# Altium project GPS01-TD to PA1616D.PrjPcb
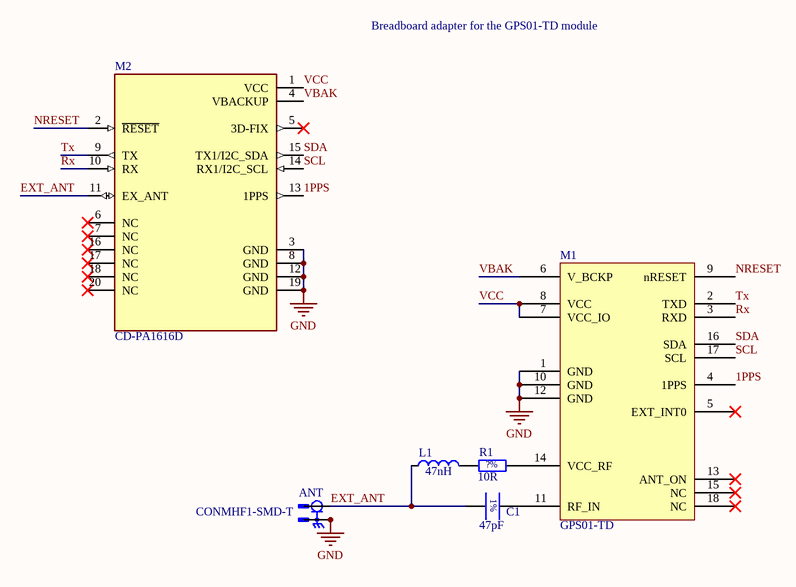
[diagram p0: Schematic.SchDoc]
1 sheet, 6 parts. Net scope: global (net labels, ports and power ports of the same name join across sheets).
Board file: PCB.PcbDoc

## Sheet Schematic.SchDoc
size A4

### Parts
ANT  CONMHF1-SMD-T  [TE_CONMHF1-SMD-T]
C1  47pF  [CAPACITOR_0805_2012M-70N]
L1  47nH  [RESISTOR_0805_2012M-50N]
M1  GPS01-TD  [GPS01-TD]
M2  CD-PA1616D  [XCVR_CD-PA1616D]
R1  10R  [RESISTOR_0805_2012M-50N]

### Nets
GND: ANT.2(GND) ANT.3(GND) ANT.4(GND) M1.1(GND) M1.10(GND) M1.12(GND) M2.3(GND) M2.8(GND) M2.12(GND) M2.19(GND)
1PPS: M1.4(1PPS) M2.13(1PPS)
EXT_ANT: ANT.1(SIG) C1.1 L1.1 M2.11(EX_ANT)
NRESET: M1.9(nRESET) M2.2(~{RESET})
Rx: M1.3(RXD) M2.10(RX)
SCL: M1.17(SCL) M2.14(RX1/I2C_SCL)
SDA: M1.16(SDA) M2.15(TX1/I2C_SDA)
Tx: M1.2(TXD) M2.9(TX)
VBAK: M1.6(V_BCKP) M2.4(VBACKUP)
VCC: M1.7(VCC_IO) M1.8(VCC) M2.1(VCC)
NetC1_2: C1.2 M1.11(RF_IN)
NetL1_2: L1.2 R1.1
NetM1_14: M1.14(VCC_RF) R1.2

Not connected (* = marked no-connect by the designer): M1 5(EXT_INT0)* 13(ANT_ON)* 15(NC)* 18(NC)*; M2 5(3D-FIX)* 6(NC)* 7(NC)* 16(NC)* 17(NC)* 18(NC)* 20(NC)*

### Notes on the sheet
- Breadboard adapter for the GPS01-TD module

### Library data of the parts
C1 = Generic Capacitor: Passive - Capacitor, Generic; Tolerance: 1%; MF Part No.: *; Value: 47pF
L1 = Generic Inductor: Passive - Inductor, Generic; MF Part No.: *; Value: 47nH
M2 = CD-PA1616D: CD-PA1616DGNSS patch antenna module; MF: CD Top; Package: Package; Price: None; Value: *; Check_prices: https://www.snapeda.com/parts/CD-PA1616D/CD+Top/view-part/?ref=eda; SnapEDA_Link: https://www.snapeda.com/parts/CD-PA1616D/CD+Top/view-part/?ref=snap; MP: CD-PA1616D; Availability: Not in stock
R1 = Generic Resistor: Passive - Resistor, Generic; Tolerance: ?%; MF Part No.: *; Value: 10R
ANT = CONMHF1-SMD-T: Package: None; Price: None; Value: *; MP: CONMHF1-SMD-T; Availability: Unavailable